# Altium schematic sheet USB_FULLSpeed.SchDoc
size A; SheetNumber: 9; SheetTotal: 16
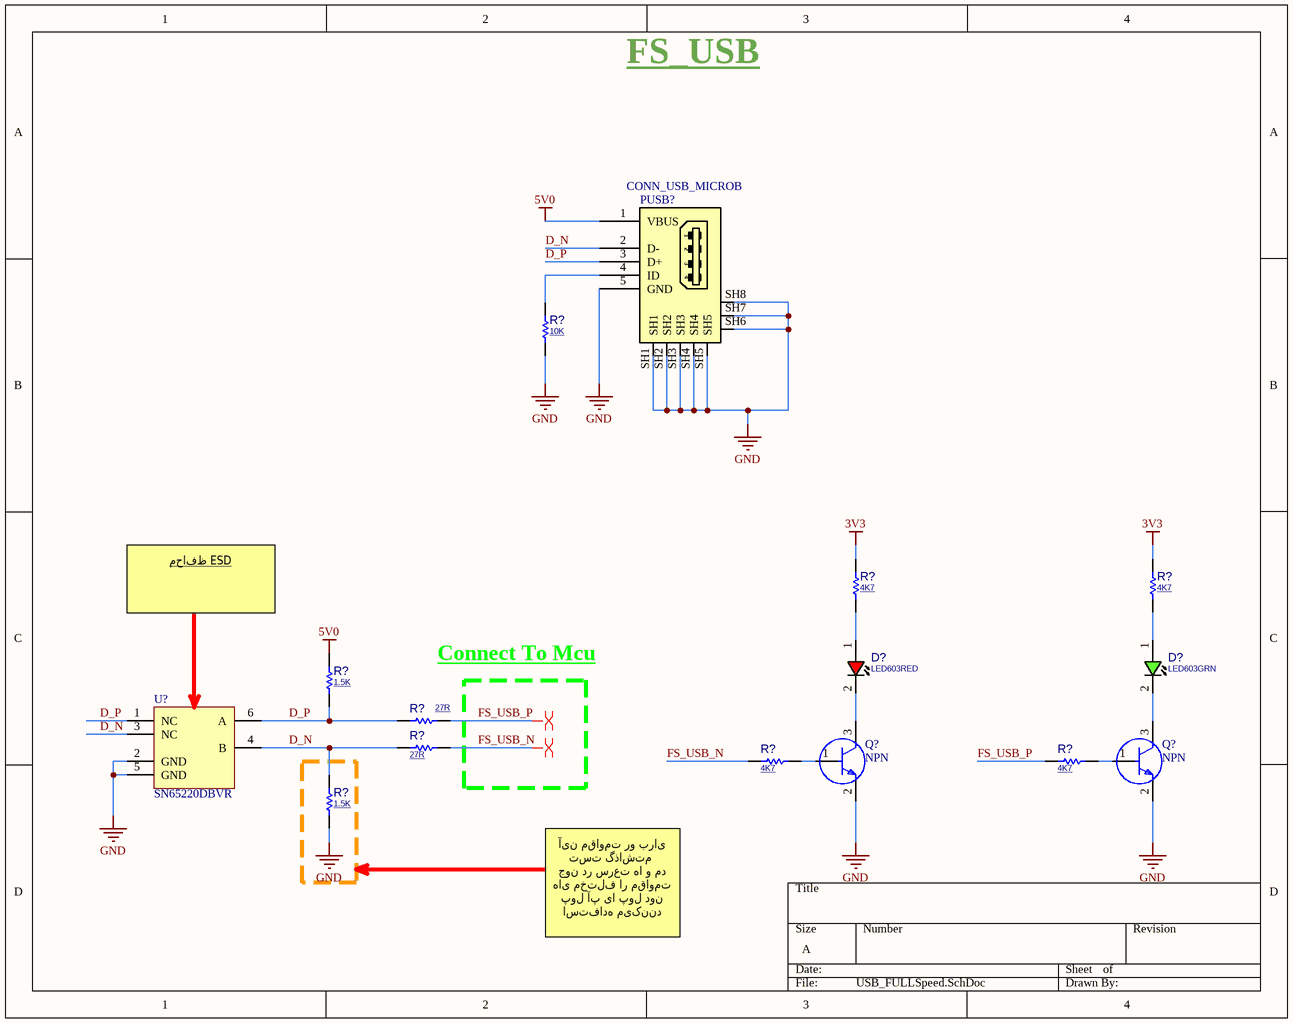
[diagram p0: USB_FULLSpeed.SchDoc]

## Parts
(Parts that share a designator on the sheet are numbered #1, #2 ... from top to bottom, then left to right.)
D?#1  LED603RED  [LED0603RED]
D?#2  LED603GRN  [LED0603GRN]
PUSB?  CONN_USB_MICROB  [USB_MICRO_B_BM_SHS]
Q?#1  NPN  [FP-SOT23-IPC_A]
Q?#2  NPN  [FP-SOT23-IPC_A]
R?#1  10K  [R0603]
R?#2  4K7  [R0603]
R?#3  4K7  [R0603]
R?#4  1.5K  [R0603]
R?#5  27R  [R0603]
R?#6  27R  [R0603]
R?#7  4K7  [R0603]
R?#8  4K7  [R0603]
R?#9  1.5K  [R0603]
U?  SN65220DBVR  [DBV0006A_N]

## Nets
3V3: R?#2.2 R?#3.2
5V0: PUSB?.1(VBUS) R?#4.1
GND: PUSB?.5(GND) PUSB?.SH1 PUSB?.SH2 PUSB?.SH3 PUSB?.SH4 PUSB?.SH5 PUSB?.SH6 PUSB?.SH7 PUSB?.SH8 Q?#1.2(E) Q?#2.2(E) R?#1.1 R?#9.2 U?.2(GND) U?.5(GND)
D_N: PUSB?.2(D-) R?#6.1 R?#9.1 U?.3(NC) U?.4(B)
D_P: PUSB?.3(D+) R?#4.2 R?#5.1 U?.1(NC) U?.6(A)
FS_USB_N: R?#6.2 R?#7.1
FS_USB_P: R?#5.2 R?#8.2
NetD?#1_1: D?#1.1(ANODE) R?#2.1
NetD?#1_2: D?#1.2(CATHODE) Q?#1.3(C)
NetD?#2_1: D?#2.1(ANODE) R?#3.1
NetD?#2_2: D?#2.2(CATHODE) Q?#2.3(C)
NetPUSB?_4: PUSB?.4(ID) R?#1.2
NetQ?#1_1: Q?#1.1(B) R?#7.2
NetQ?#2_1: Q?#2.1(B) R?#8.1

## Layout directives
differential pair: FS_USB_N, FS_USB_P

## Notes on the sheet
- FS_USB
- محافظ ESD
- Connect To Mcu
- آین مقاومت رو برای تست گذاشتم
  جون در سرعت ها و مد های مختلف ار مقاومت پول آپ یا پول دون استفاده میکنند

## Library data of the parts
D?#1 = LED_SMD_0603_RED: LED, SMD, 0603, RED; PARAM: 30mA, 640nm; DESC: DESCRIPTION; MANF_P#: MANF_PART#; PARAM2: 1.8~2.5V; MANF: MANF; ASSEMBLY: ASSEMBLY; PRICE: PRICE; VALUE: LED603RED
D?#2 = LED_SMD_0603_GRN: LED, SMD, 0603, GREEN; PARAM: 20mA; MANF: Kingbright; DESC: DESCRIPTION; MANF_P#: APT1608SGC; PARAM2: 2.2V; ASSEMBLY: ASSEMBLY; PRICE: 1: 0.14$, 100: 6.8$; VALUE: LED603GRN
PUSB? = CONN_USB_MICRO_B_BM_SHS: CONN, USB, MICRO B, R/A, SMD, BOTTOM MOUNT; MANF_P#: 47346-0001; MANF: Molex; MANF_P#2: HIROSE ZX62-AB-5PA; PARAM2: 30VAC; PARAM: 1.8A, -20~85oC; PRICE: 0.75$; VALUE: CONN_USB_MICROB
Q?#1 Q?#2 = CMP-2000-04931-2: Frequency: 300MHz; Collector Emitter Voltage (VCEO): 40V; Power Dissipation: 350mW; Element Configuration: Single; Max Power Dissipation: 300mW; Max Collector Current: 200mA; Collector Emitter Saturation Voltage: 300mV; Number of Elements: 1; hFE Min: 100; Collector Base Voltage (VCBO): 60V; Emitter Base Voltage (VEBO): 6V; Contact Plating: Tin; Package Quantity: 3000; Max Frequency: 300MHz; REACH SVHC: No SVHC; Max Operating Temperature: 150°C; Width: 1.4mm; Voltage Rating (DC): 40V; Radiation Hardening: No; Case/Package: SOT-23; Height: 1mm; Collector Emitter Breakdown Voltage: 40V; Length: 3.05mm; Polarity: NPN; Packaging: Tape and Reel; Number of Pins: 3; Min Operating Temperature: -55°C; Gain Bandwidth Product: 300MHz; Mount: Surface Mount; Weight: 0.000282oz; Continuous Collector Current: 200mA; Transition Frequency: 300MHz; Max Breakdown Voltage: 40V; Lead Free: Lead Free
R?#1-R?#9 = RES_SMD: RESISTOR, SMD; PARAM: -W; DESC: DESCRIPTION; DIST#: MOUSER; PARAM2: 1%; MANF_P#: -; MANF: -; ASSEMBLY: ASSEMBLY; PRICE: 100= 0.5$
  R?#1: VALUE: 10K
  R?#2 R?#3 R?#7 R?#8: VALUE: 4K7
  R?#4 R?#9: VALUE: 1.5K
  R?#5 R?#6: VALUE: 27R
U? = SN65220DBVR: Single Universal Serial Bus Port Transient Suppressor, 2 Channels, -40 to +85 degC, 6-pin SOT-23 (DBV), Green (RoHS & no Sb/Br); Manufacturer: Texas Instruments; IO Leakage Current(nA): 1000; Breakdown Voltage(Min)(V): 7; SubFamily: ESD Solution; USB Full Speed: TRUE; IO Capacitance(Typ)(pF): 35; PackageVersion: revK, Mar-2006; Mounting Technology: Surface Mount; PackageDescription: 6-Pin Plastic Small-Outline Package, 2.9 x 1.6 mm Body, 0.95 mm Pitch, 2.8 mm Lead Span; PackageReference: DBV0006A; Eco-Plan: Green (RoHS & no Sb/Br); ComponentLink3Description: URL Link1; ComponentLink2Description: Datasheet; ComponentLink1Description: Manufacturer URL; DatasheetVersion: SLLS266G; PartNumber: SN65220DBVR